# Altium schematic sheet RK3576-SMC.SMARC_3 (0021.0 A0).SchDoc
size 420 x 297 mm; Scale: -; DocumentType: Схема электрическая принципиальная; DocumentGOSTLIt1: ㅤ; DocumentGOSTLIt2: ㅤ; DocumentGOSTLIt3: ㅤ; DocumentGOSTNote: Элементы, отмеченные *, используются при трассировке печатной платы, в состав модуля не включаются; SheetNumber: 3; SheetTotal: 3; DocumentTypeShort: Э3; DocumentInvertoryNumber: ㅤ
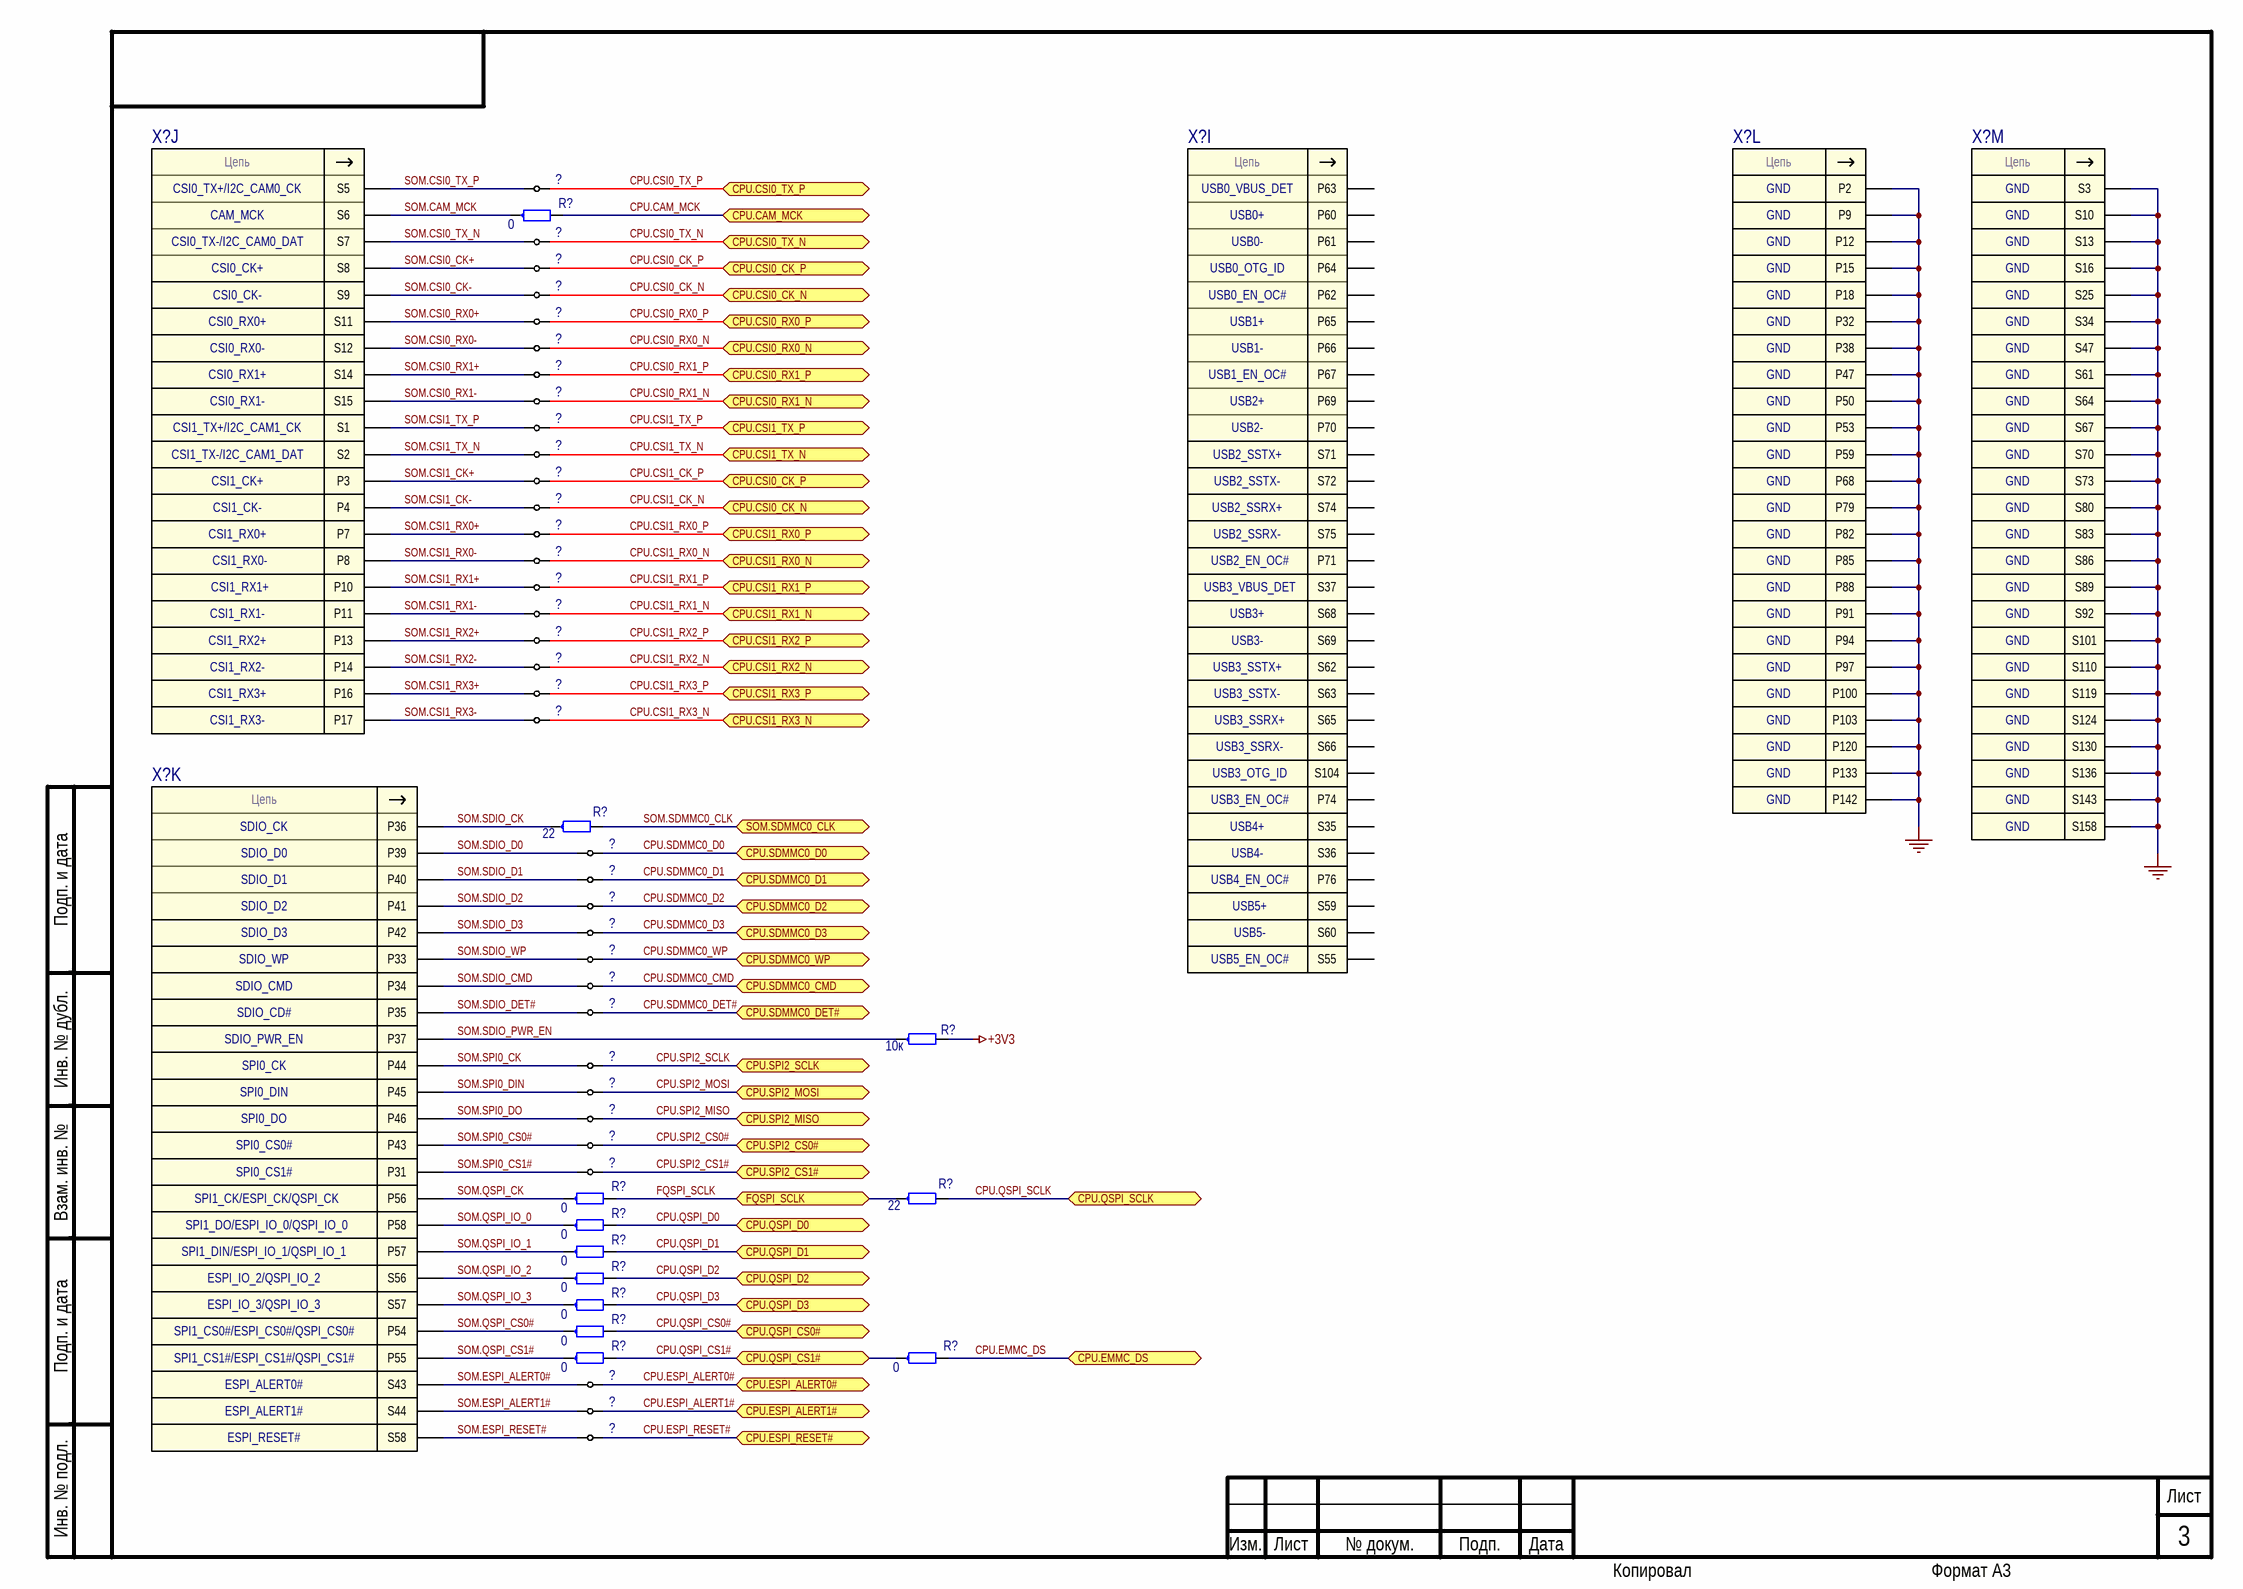
[diagram p0: RK3576-SMC.SMARC_3 (0021.0 A0).SchDoc]

## Parts
(Parts that share a designator on the sheet are numbered #1, #2 ... from top to bottom, then left to right.)
?#1  NetTie  [NetTie_0_6-1_25mm_close]  (value not drawn)  (net tie, no BOM)
?#2  NetTie  [NetTie_0_6-1_25mm_close]  (value not drawn)  (net tie, no BOM)
?#3  NetTie  [NetTie_0_6-1_25mm_close]  (value not drawn)  (net tie, no BOM)
?#4  NetTie  [NetTie_0_6-1_25mm_close]  (value not drawn)  (net tie, no BOM)
?#5  NetTie  [NetTie_0_6-1_25mm_close]  (value not drawn)  (net tie, no BOM)
?#6  NetTie  [NetTie_0_6-1_25mm_close]  (value not drawn)  (net tie, no BOM)
?#7  NetTie  [NetTie_0_6-1_25mm_close]  (value not drawn)  (net tie, no BOM)
?#8  NetTie  [NetTie_0_6-1_25mm_close]  (value not drawn)  (net tie, no BOM)
?#9  NetTie  [NetTie_0_6-1_25mm_close]  (value not drawn)  (net tie, no BOM)
?#10  NetTie  [NetTie_0_6-1_25mm_close]  (value not drawn)  (net tie, no BOM)
?#11  NetTie  [NetTie_0_6-1_25mm_close]  (value not drawn)  (net tie, no BOM)
?#12  NetTie  [NetTie_0_6-1_25mm_close]  (value not drawn)  (net tie, no BOM)
?#13  NetTie  [NetTie_0_6-1_25mm_close]  (value not drawn)  (net tie, no BOM)
?#14  NetTie  [NetTie_0_6-1_25mm_close]  (value not drawn)  (net tie, no BOM)
?#15  NetTie  [NetTie_0_6-1_25mm_close]  (value not drawn)  (net tie, no BOM)
?#16  NetTie  [NetTie_0_6-1_25mm_close]  (value not drawn)  (net tie, no BOM)
?#17  NetTie  [NetTie_0_6-1_25mm_close]  (value not drawn)  (net tie, no BOM)
?#18  NetTie  [NetTie_0_6-1_25mm_close]  (value not drawn)  (net tie, no BOM)
?#19  NetTie  [NetTie_0_6-1_25mm_close]  (value not drawn)  (net tie, no BOM)
?#20  NetTie  [NetTie_0_6-1_25mm_close]  (value not drawn)  (net tie, no BOM)
?#21  NetTie  [NetTie_0_6-1_25mm_close]  (value not drawn)  (net tie, no BOM)
?#22  NetTie  [NetTie_0_6-1_25mm_close]  (value not drawn)  (net tie, no BOM)
?#23  NetTie  [NetTie_0_6-1_25mm_close]  (value not drawn)  (net tie, no BOM)
?#24  NetTie  [NetTie_0_6-1_25mm_close]  (value not drawn)  (net tie, no BOM)
?#25  NetTie  [NetTie_0_6-1_25mm_close]  (value not drawn)  (net tie, no BOM)
?#26  NetTie  [NetTie_0_6-1_25mm_close]  (value not drawn)  (net tie, no BOM)
?#27  NetTie  [NetTie_0_6-1_25mm_close]  (value not drawn)  (net tie, no BOM)
?#28  NetTie  [NetTie_0_6-1_25mm_close]  (value not drawn)  (net tie, no BOM)
?#29  NetTie  [NetTie_0_6-1_25mm_close]  (value not drawn)  (net tie, no BOM)
?#30  NetTie  [NetTie_0_6-1_25mm_close]  (value not drawn)  (net tie, no BOM)
?#31  NetTie  [NetTie_0_6-1_25mm_close]  (value not drawn)  (net tie, no BOM)
?#32  NetTie  [NetTie_0_6-1_25mm_close]  (value not drawn)  (net tie, no BOM)
?#33  NetTie  [NetTie_0_6-1_25mm_close]  (value not drawn)  (net tie, no BOM)
?#34  NetTie  [NetTie_0_6-1_25mm_close]  (value not drawn)  (net tie, no BOM)
?#35  NetTie  [NetTie_0_6-1_25mm_close]  (value not drawn)  (net tie, no BOM)
R?#1  0  [resc0603x26n]
R?#2  22  [resc0603x26n]
R?#3  10к  [resc5025x65n]
R?#4  0  [resc0603x26n]
R?#5  22  [resc0603x26n]
R?#6  0  [resc0603x26n]
R?#7  0  [resc0603x26n]
R?#8  0  [resc0603x26n]
R?#9  0  [resc0603x26n]
R?#10  0  [resc0603x26n]
R?#11  0  [resc0603x26n]
R?#12  0  [resc0603x26n]
X?#1  SMARC  [con_smarc]  (value not drawn)  (part J of 13)
X?#2  SMARC  [con_smarc]  (value not drawn)  (part I of 13)
X?#3  SMARC  [con_smarc]  (value not drawn)  (part L of 13)
X?#4  SMARC  [con_smarc]  (value not drawn)  (part M of 13)
X?#5  SMARC  [con_smarc]  (value not drawn)  (part K of 13)

## Ports
CPU.CAM_MCK (bidir), CPU.CSI0_CK_N (bidir), CPU.CSI0_CK_P (bidir), CPU.CSI0_RX0_N (bidir), CPU.CSI0_RX0_P (bidir), CPU.CSI0_RX1_N (bidir), CPU.CSI0_RX1_P (bidir), CPU.CSI0_TX_N (bidir), CPU.CSI0_TX_P (bidir), CPU.CSI1_RX0_N (bidir), CPU.CSI1_RX0_P (bidir), CPU.CSI1_RX1_N (bidir), CPU.CSI1_RX1_P (bidir), CPU.CSI1_RX2_N (bidir), CPU.CSI1_RX2_P (bidir), CPU.CSI1_RX3_N (bidir), CPU.CSI1_RX3_P (bidir), CPU.CSI1_TX_N (bidir), CPU.CSI1_TX_P (bidir), CPU.EMMC_DS (bidir), CPU.ESPI_ALERT0# (bidir), CPU.ESPI_ALERT1# (bidir), CPU.ESPI_RESET# (bidir), CPU.QSPI_CS0# (bidir), CPU.QSPI_CS1# (bidir), CPU.QSPI_D0 (bidir), CPU.QSPI_D1 (bidir), CPU.QSPI_D2 (bidir), CPU.QSPI_D3 (bidir), CPU.QSPI_SCLK (bidir), CPU.SDMMC0_CMD (bidir), CPU.SDMMC0_D0 (bidir), CPU.SDMMC0_D1 (bidir), CPU.SDMMC0_D2 (bidir), CPU.SDMMC0_D3 (bidir), CPU.SDMMC0_DET# (bidir), CPU.SDMMC0_WP (bidir), CPU.SPI2_CS0# (bidir), CPU.SPI2_CS1# (bidir), CPU.SPI2_MISO (bidir), CPU.SPI2_MOSI (bidir), CPU.SPI2_SCLK (bidir), FQSPI_SCLK (bidir), SOM.SDMMC0_CLK (bidir)

## Nets
+3V3: R?#3.2
SOM.GND: X?#3.P2 X?#3.P9 X?#3.P12 X?#3.P15 X?#3.P18 X?#3.P32 X?#3.P38 X?#3.P47 X?#3.P50 X?#3.P53 X?#3.P59 X?#3.P68 X?#3.P79 X?#3.P82 X?#3.P85 X?#3.P88 X?#3.P91 X?#3.P94 X?#3.P97 X?#3.P100 X?#3.P103 X?#3.P120 X?#3.P133 X?#3.P142 X?#4.S3 X?#4.S10 X?#4.S13 X?#4.S16 X?#4.S25 X?#4.S34 X?#4.S47 X?#4.S61 X?#4.S64 X?#4.S67 X?#4.S70 X?#4.S73 X?#4.S80 X?#4.S83 X?#4.S86 X?#4.S89 X?#4.S92 X?#4.S101 X?#4.S110 X?#4.S119 X?#4.S124 X?#4.S130 X?#4.S136 X?#4.S143 X?#4.S158
CPU.CAM_MCK: R?#1.2 ; port CPU.CAM_MCK
CPU.CSI0_CK_N: ?#4.2 ?#12.2 ; port CPU.CSI0_CK_N  [also labelled CPU.CSI1_CK_N]
CPU.CSI0_CK_P: ?#3.2 ?#11.2 ; port CPU.CSI0_CK_P  [also labelled CPU.CSI1_CK_P]
CPU.CSI0_RX0_N: ?#6.2 ; port CPU.CSI0_RX0_N
CPU.CSI0_RX0_P: ?#5.2 ; port CPU.CSI0_RX0_P
CPU.CSI0_RX1_N: ?#8.2 ; port CPU.CSI0_RX1_N
CPU.CSI0_RX1_P: ?#7.2 ; port CPU.CSI0_RX1_P
CPU.CSI0_TX_N: ?#2.2 ; port CPU.CSI0_TX_N
CPU.CSI0_TX_P: ?#1.2 ; port CPU.CSI0_TX_P
CPU.CSI1_RX0_N: ?#14.2 ; port CPU.CSI1_RX0_N
CPU.CSI1_RX0_P: ?#13.2 ; port CPU.CSI1_RX0_P
CPU.CSI1_RX1_N: ?#16.2 ; port CPU.CSI1_RX1_N
CPU.CSI1_RX1_P: ?#15.2 ; port CPU.CSI1_RX1_P
CPU.CSI1_RX2_N: ?#18.2 ; port CPU.CSI1_RX2_N
CPU.CSI1_RX2_P: ?#17.2 ; port CPU.CSI1_RX2_P
CPU.CSI1_RX3_N: ?#20.2 ; port CPU.CSI1_RX3_N
CPU.CSI1_RX3_P: ?#19.2 ; port CPU.CSI1_RX3_P
CPU.CSI1_TX_N: ?#10.2 ; port CPU.CSI1_TX_N
CPU.CSI1_TX_P: ?#9.2 ; port CPU.CSI1_TX_P
CPU.EMMC_DS: R?#12.2 ; port CPU.EMMC_DS
CPU.ESPI_ALERT0#: ?#33.2 ; port CPU.ESPI_ALERT0#
CPU.ESPI_ALERT1#: ?#34.2 ; port CPU.ESPI_ALERT1#
CPU.ESPI_RESET#: ?#35.2 ; port CPU.ESPI_RESET#
CPU.QSPI_CS0#: R?#10.2 ; port CPU.QSPI_CS0#
CPU.QSPI_CS1#: R?#11.2 R?#12.1 ; port CPU.QSPI_CS1#
CPU.QSPI_D0: R?#6.2 ; port CPU.QSPI_D0
CPU.QSPI_D1: R?#7.2 ; port CPU.QSPI_D1
CPU.QSPI_D2: R?#8.2 ; port CPU.QSPI_D2
CPU.QSPI_D3: R?#9.2 ; port CPU.QSPI_D3
CPU.QSPI_SCLK: R?#5.2 ; port CPU.QSPI_SCLK
CPU.SDMMC0_CMD: ?#26.2 ; port CPU.SDMMC0_CMD
CPU.SDMMC0_D0: ?#21.2 ; port CPU.SDMMC0_D0
CPU.SDMMC0_D1: ?#22.2 ; port CPU.SDMMC0_D1
CPU.SDMMC0_D2: ?#23.2 ; port CPU.SDMMC0_D2
CPU.SDMMC0_D3: ?#24.2 ; port CPU.SDMMC0_D3
CPU.SDMMC0_DET#: ?#27.2 ; port CPU.SDMMC0_DET#
CPU.SDMMC0_WP: ?#25.2 ; port CPU.SDMMC0_WP
CPU.SPI2_CS0#: ?#31.2 ; port CPU.SPI2_CS0#
CPU.SPI2_CS1#: ?#32.2 ; port CPU.SPI2_CS1#
CPU.SPI2_MISO: ?#30.2 ; port CPU.SPI2_MISO
CPU.SPI2_MOSI: ?#29.2 ; port CPU.SPI2_MOSI
CPU.SPI2_SCLK: ?#28.2 ; port CPU.SPI2_SCLK
FQSPI_SCLK: R?#4.2 R?#5.1 ; port FQSPI_SCLK
SOM.CAM_MCK: R?#1.1 X?#1.S6
SOM.CSI0_CK+: ?#3.1 X?#1.S8
SOM.CSI0_CK-: ?#4.1 X?#1.S9
SOM.CSI0_RX0+: ?#5.1 X?#1.S11
SOM.CSI0_RX0-: ?#6.1 X?#1.S12
SOM.CSI0_RX1+: ?#7.1 X?#1.S14
SOM.CSI0_RX1-: ?#8.1 X?#1.S15
SOM.CSI0_TX_N: ?#2.1 X?#1.S7
SOM.CSI0_TX_P: ?#1.1 X?#1.S5
SOM.CSI1_CK+: ?#11.1 X?#1.P3
SOM.CSI1_CK-: ?#12.1 X?#1.P4
SOM.CSI1_RX0+: ?#13.1 X?#1.P7
SOM.CSI1_RX0-: ?#14.1 X?#1.P8
SOM.CSI1_RX1+: ?#15.1 X?#1.P10
SOM.CSI1_RX1-: ?#16.1 X?#1.P11
SOM.CSI1_RX2+: ?#17.1 X?#1.P13
SOM.CSI1_RX2-: ?#18.1 X?#1.P14
SOM.CSI1_RX3+: ?#19.1 X?#1.P16
SOM.CSI1_RX3-: ?#20.1 X?#1.P17
SOM.CSI1_TX_N: ?#10.1 X?#1.S2
SOM.CSI1_TX_P: ?#9.1 X?#1.S1
SOM.ESPI_ALERT0#: ?#33.1 X?#5.S43
SOM.ESPI_ALERT1#: ?#34.1 X?#5.S44
SOM.ESPI_RESET#: ?#35.1 X?#5.S58
SOM.QSPI_CK: R?#4.1 X?#5.P56
SOM.QSPI_CS0#: R?#10.1 X?#5.P54
SOM.QSPI_CS1#: R?#11.1 X?#5.P55
SOM.QSPI_IO_0: R?#6.1 X?#5.P58
SOM.QSPI_IO_1: R?#7.1 X?#5.P57
SOM.QSPI_IO_2: R?#8.1 X?#5.S56
SOM.QSPI_IO_3: R?#9.1 X?#5.S57
SOM.SDIO_CK: R?#2.1 X?#5.P36
SOM.SDIO_CMD: ?#26.1 X?#5.P34
SOM.SDIO_D0: ?#21.1 X?#5.P39
SOM.SDIO_D1: ?#22.1 X?#5.P40
SOM.SDIO_D2: ?#23.1 X?#5.P41
SOM.SDIO_D3: ?#24.1 X?#5.P42
SOM.SDIO_DET#: ?#27.1 X?#5.P35
SOM.SDIO_PWR_EN: R?#3.1 X?#5.P37
SOM.SDIO_WP: ?#25.1 X?#5.P33
SOM.SDMMC0_CLK: R?#2.2 ; port SOM.SDMMC0_CLK
SOM.SPI0_CK: ?#28.1 X?#5.P44
SOM.SPI0_CS0#: ?#31.1 X?#5.P43
SOM.SPI0_CS1#: ?#32.1 X?#5.P31
SOM.SPI0_DIN: ?#29.1 X?#5.P45
SOM.SPI0_DO: ?#30.1 X?#5.P46

Not connected (* = marked no-connect by the designer): X?#2 P60 P61 P62 P63 P64 P65 P66 P67 P69 P70 P71 P74 P76 S35 S36 S37 S55 S59 S60 S62 S63 S65 S66 S68 S69 S71 S72 S74 S75 S104

## Notes on the sheet
- Подп. и дата
- Инв. № дубл.
- Взам. инв. №
- Инв. № подл.
- Изм.
- Лист
- № докум.
- Подп.
- Дата
- Копировал
- Формат А3
- (in symbol SMARC, part I) Цепь; USB0_VBUS_DET; USB0+; USB0-; USB0_OTG_ID; USB0_EN_OC#; USB1+; USB1-; USB1_EN_OC#; USB2+; USB2-; USB2_SSTX+; USB2_SSTX-; USB2_SSRX+; USB2_SSRX-; USB2_EN_OC#; USB3_VBUS_DET; USB3+; USB3-; USB3_SSTX+; USB3_SSTX-; USB3_SSRX+; USB3_SSRX-; USB3_OTG_ID; USB3_EN_OC#; USB4+; USB4-; USB4_EN_OC#; USB5+; USB5-; USB5_EN_OC#
- (in symbol SMARC, part J) Цепь; CSI0_TX+/I2C_CAM0_CK; CAM_MCK; CSI0_TX-/I2C_CAM0_DAT; CSI0_CK+; CSI0_CK-; CSI0_RX0+; CSI0_RX0-; CSI0_RX1+; CSI0_RX1-; CSI1_TX+/I2C_CAM1_CK; CSI1_TX-/I2C_CAM1_DAT; CSI1_CK+; CSI1_CK-; CSI1_RX0+; CSI1_RX0-; CSI1_RX1+; CSI1_RX1-; CSI1_RX2+; CSI1_RX2-; CSI1_RX3+; CSI1_RX3-
- (in symbol SMARC, part K) Цепь; SDIO_CK; SDIO_D0; SDIO_D1; SDIO_D2; SDIO_D3; SDIO_WP; SDIO_CMD; SDIO_CD#; SDIO_PWR_EN; SPI0_CK; SPI0_DIN; SPI0_DO; SPI0_CS0#; SPI0_CS1#; SPI1_CK/ESPI_CK/QSPI_CK; SPI1_DO/ESPI_IO_0/QSPI_IO_0; SPI1_DIN/ESPI_IO_1/QSPI_IO_1; ESPI_IO_2/QSPI_IO_2; ESPI_IO_3/QSPI_IO_3; SPI1_CS0#/ESPI_CS0#/QSPI_CS0#; SPI1_CS1#/ESPI_CS1#/QSPI_CS1#; ESPI_ALERT0#; ESPI_ALERT1#; ESPI_RESET#
- (in symbol SMARC, part L) Цепь; GND
- (in symbol SMARC, part M) Цепь; GND

## Library data of the parts
?#1-?#35 = NetTie_0.6-1.25_Close: Part_ID: ATB-00257; Rule: UNIONINDEX=0|RULEKIND=Clearance|NETSCOPE=DifferentNets|LAYERKIND=SameLayer|NAME=Schematic Clearance Constraint|GAP=0mil|GENERICCLEARANCE=0mil|IGNOREPADTOPADCLEARANCEINFOOTPRINT=TRUE|OBJECTCLEARANCES= |UNIT=Metric; Rule: UNIONINDEX=0|RULEKIND=PolygonConnect|NETSCOPE=AnyNet|LAYERKIND=SameLayer|NAME=Schematic Polygon Connect Style|CONNECTSTYLE=Direct|RELIEFCONDUCTORWIDTH=10mil|RELIEFENTRIES=4|POLYGONRELIEFANGLE=45 Angle|AIRGAPWIDTH=10mil|UNIT=Metric; Rule: UNIONINDEX=0|RULEKIND=ShortCircuit|NETSCOPE=AnyNet|LAYERKIND=SameLayer|NAME=Schematic Short-Circuit Constraint|ALLOWED=TRUE|UNIT=Metric; Тип ЭКБ: Элементы; Тип компонента: Перемычка; Автор: Чепиков И.В.; Part Number: NetTie_0.6-1.25_Close; Наименование: NetTie_0.6-1.25_Close; Value: -; Part_Number: NetTie_0.6-1.25_Close; Дата: 11.11.2024; Device: NetTie_0.6-1.25_Close; NameFromManufacturer: NetTie_0.6-1.25_Close
R?#1 R?#4 R?#6-R?#12 = RC0201JR-070RL: Резисторы (chip) общего назначения; Part_ID: ATB-09733; Manufacturer: Yageo; Schematic_Part: R_min_val,R_min,R_val,R; Наименование: 0201-0.05W-0±5%; Voltage: 30V; Power: 0.05; Точность: ±5%; Температура: -55 +125; Вариант установки: Поверхностный; Код ERP: E2-00008416; Photo: Photos\Photos\Yageo_RC0075-RC2512.jpg; Автор: Чепиков И.В.; Device: 0201-0.05W-0±5%_Yageo; Library Ref 2: R; Part Number: RC0201JR-070RL; Тип ЭКБ: Резисторы; Datasheet: Datasheets\Resistors\PYu-RC_Group_51_RoHS_L_12.pdf; Тип компонента: Резистор; Номинал: 0; Value: 0; Part_Number: RC0201JR-070RL; PCB_Footprint: resc0603x26n; Тип корпуса: Chip; Height: 0.26; Производитель: Yageo; Website: https://www.yageo.com/upload/media/product/products/datasheet/rchip/PYu-RC_Group_51_RoHS_L_12.pdf; Дата: 14.01.2025; NameFromManufacturer: RC0201JR-070RL; ComponentLink1URL: https://www.yageo.com/upload/media/product/products/datasheet/rchip/PYu-RC_Group_51_RoHS_L_12.pdf; ComponentLink1Description: PYu-RC_Group_51_RoHS_L_12.pdf; Original PN: RC0201JR-070RL
R?#2 R?#5 = RC0201FR-0722RL: Резисторы (chip) общего назначения; Part_ID: ATB-09726; Manufacturer: Yageo; Schematic_Part: R_min_val,R_min,R_val,R; Наименование: 0201-0.05W-22-200ppm±1%; Voltage: 30V; Power: 0.05; Точность: ±1%; ТКС (от  -60 до +20 град): ± 200; Ряд: E24; Температура: -55 +125; Вариант установки: Поверхностный; Код ERP: E2-00006876; Photo: Photos\Photos\Yageo_RC0075-RC2512.jpg; Автор: Чепиков И.В.; Device: 0201-0.05W-22-200ppm±1%_Yageo; Library Ref 2: R; Part Number: RC0201FR-0722RL; Тип ЭКБ: Резисторы; Datasheet: Datasheets\Resistors\PYu-RC_Group_51_RoHS_L_12.pdf; Тип компонента: Резистор; Номинал: 22; Value: 22; ТКС (от +20 град до max): ± 200; Part_Number: RC0201FR-0722RL; PCB_Footprint: resc0603x26n; Тип корпуса: Chip; Height: 0.26; Производитель: Yageo; Website: https://www.yageo.com/upload/media/product/products/datasheet/rchip/PYu-RC_Group_51_RoHS_L_12.pdf; Дата: 13.01.2025; NameFromManufacturer: RC0201FR-0722RL; ComponentLink1URL: https://www.yageo.com/upload/media/product/products/datasheet/rchip/PYu-RC_Group_51_RoHS_L_12.pdf; ComponentLink1Description: PYu-RC_Group_51_RoHS_L_12.pdf; Original PN: RC0201FR-0722RL
R?#3 = RC2010FK-0710KL: Резисторы (chip) общего назначения; Part_ID: ATB-00048; Manufacturer: Yageo; Schematic_Part: R_min_val,R_min,R_val,R; Наименование: 2010-0.75W-10K-100ppm±1%; Value: 10k; Voltage: 200V; Power: 0.75; Точность: ±1%; ТКС (от  -60 до +20 град): ± 100; Ряд: E24; Температура: -55 +155; Вариант установки: Поверхностный; Код ERP: E2-00020426; Photo: Photos\Photos\Yageo_RC0075-RC2512.jpg; Автор: Чепиков И.В.; Device: 2010-0.75W-10K-100ppm±1%_Yageo; Library Ref 2: R; Part Number: RC2010FK-0710KL; Тип ЭКБ: Резисторы; Datasheet: Datasheets\Resistors\PYu-RC_Group_51_RoHS_L_12.pdf; Тип компонента: Резистор; Номинал: 10к; ТКС (от +20 град до max): ± 100; Part_Number: RC2010FK-0710KL; PCB_Footprint: resc5025x65n; Тип корпуса: Chip; Height: 0.65; Производитель: Yageo; Website: https://www.yageo.com/upload/media/product/products/datasheet/rchip/PYu-RC_Group_51_RoHS_L_12.pdf; Дата: 27.02.2024; NameFromManufacturer: RC2010FK-0710KL; ComponentLink1URL: https://www.yageo.com/upload/media/product/products/datasheet/rchip/PYu-RC_Group_51_RoHS_L_12.pdf; ComponentLink1Description: PYu-RC_Group_51_RoHS_L_12.pdf; Original PN: RC2010FK-0710KL
X?#1-X?#5 = SMARC: Краевой разъем SMARC_V21, 314 конт.; Part_ID: ATB-00378; Manufacturer: SMARC 2.1 Specification; Тип ЭКБ: Соединители; Тип компонента: Вилка Краевой Smarc; Photo: Photos\Photos\SMARC.jpg; Автор: Чепиков И.В.; Part Number: SMARC; Наименование: SMARC; Datasheet: Datasheets\Connectors\SMARC_V21-specification.pdf; Schematic_Part: SMARC_v2_1_XP; Value: SMARC; Part_Number: SMARC; PCB_Footprint: con_smarc; Website: https://www.isee.biz/images/Manuals/smarc/SMARC_Hardware_Specification_V211.pdf; Дата: 01.07.2024; Device: SMARC; NameFromManufacturer: SMARC; ComponentLink1URL: https://www.isee.biz/images/Manuals/smarc/SMARC_Hardware_Specification_V211.pdf; ComponentLink1Description: SMARC_V21-specification.pdf; Original PN: SMARC